# EAGLE design cosv-carrier-teensy40 (EAGLE 7.6.0)
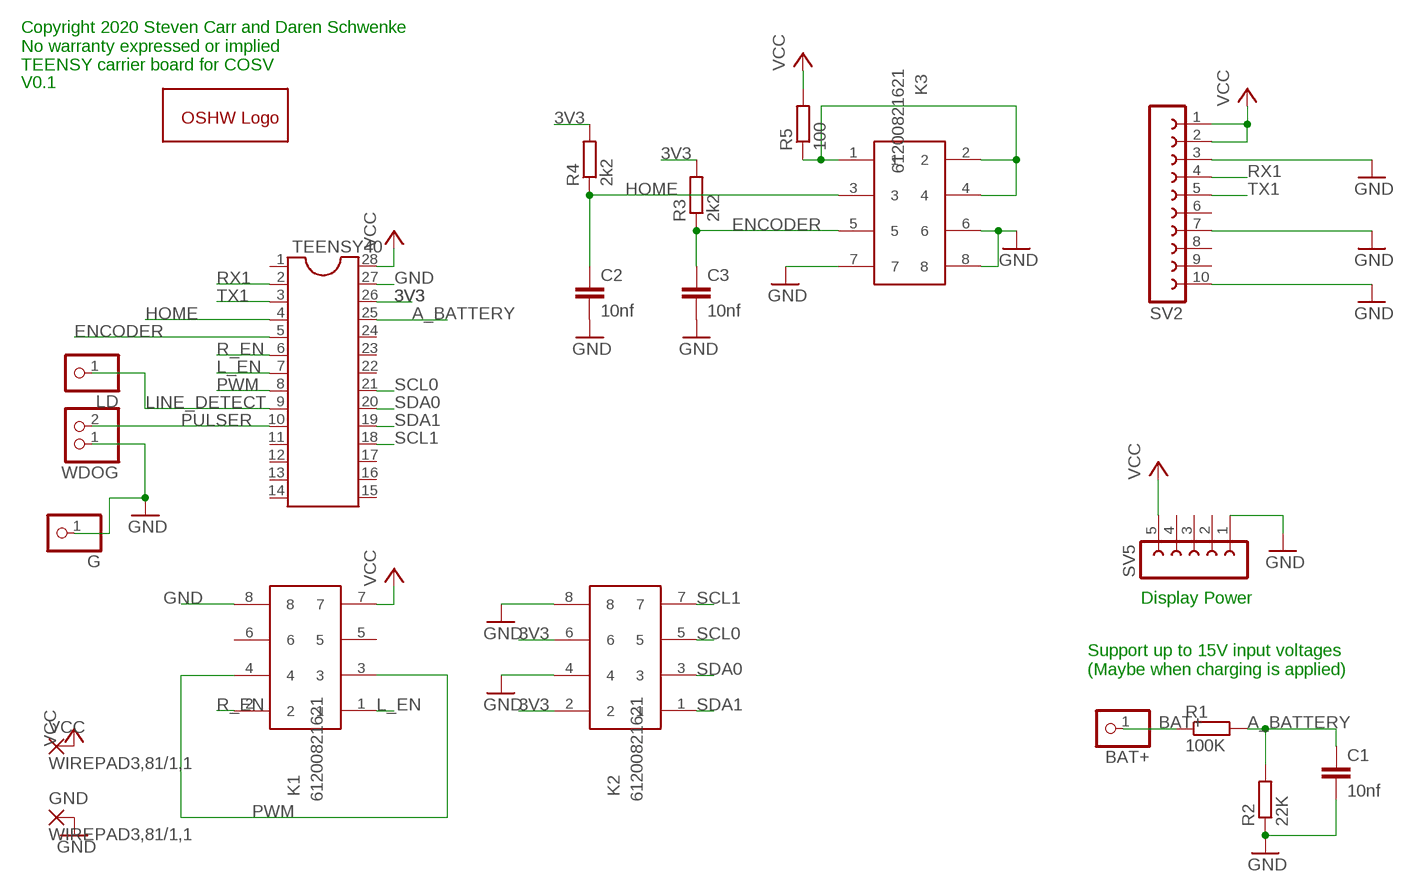
[diagram p0: schematic, sheet 1]

## Parts
BAT+  PINHD-1X01_2.54-S  [1X01-S]
C1  10nf  C-EUC1206  [C1206]
C2  10nf  C-EUC1206  [C1206]
C3  10nf  C-EUC1206  [C1206]
G  PINHD-1X01_2.54-S  [1X01-S]
GND  WIREPAD3,81/1,1  [3,81/1,1]
GOLD_ORB_SM1  OSHWLOGOLOGO8MM  [OSHW_8MM]
K1  61200821621  [61200821621]
K2  61200821621  [61200821621]
K3  61200821621  [61200821621]
LD  PINHD-1X01_2.54-S  [1X01-S]
R1  100K  R-EU_R1206  [R1206]
R2  22K  R-EU_R1206  [R1206]
R3  2k2  R-EU_R1206  [R1206]
R4  2k2  R-EU_R1206  [R1206]
R5  100  R-EU_R1206  [R1206]
SV2  FE10-1  [FE10]
SV5  FE05W  [FE05W]
TEENSY40  DIL28  [DIL28-6]
VCC  WIREPAD3,81/1,1  [3,81/1,1]
WDOG  PINHD-1X2  [1X02]

## Nets
3V3: K2.2 K2.6 R3.2 R4.2 TEENSY40.26
A_BATTERY: C1.1 R1.2 R2.2 TEENSY40.25
BAT+: BAT+.1 R1.1
ENCODER: C3.1 K3.5 R3.1 TEENSY40.5
GND: C1.2 C2.2 C3.2 G.1 GND.1(P) K1.8 K2.4 K2.8 K3.6 K3.7 K3.8 R2.1 SV2.3 SV2.7 SV2.10 SV5.1 TEENSY40.27 WDOG.1
HOME: C2.1 K3.3 R4.1 TEENSY40.4
L_EN: K1.1 TEENSY40.7
LINE_DETECT: LD.1 TEENSY40.9
N$1: K3.1 K3.2 K3.4 R5.1
PULSER: TEENSY40.10 WDOG.2
PWM: K1.3 K1.4 TEENSY40.8
R_EN: K1.2 TEENSY40.6
RX1: SV2.4 TEENSY40.2
SCL0: K2.5 TEENSY40.21
SCL1: K2.7 TEENSY40.18
SDA0: K2.3 TEENSY40.20
SDA1: K2.1 TEENSY40.19
TX1: SV2.5 TEENSY40.3
VCC: K1.7 R5.2 SV2.1 SV2.2 SV5.5 TEENSY40.28 VCC.1(P)
Unconnected: K1.5 K1.6 SV2.6 SV2.8 SV2.9 SV5.2 SV5.3 SV5.4 TEENSY40.1 TEENSY40.11 TEENSY40.12 TEENSY40.13 TEENSY40.14 TEENSY40.15 TEENSY40.16 TEENSY40.17 TEENSY40.22 TEENSY40.23 TEENSY40.24

## Notes on the sheet
- Copyright 2020 Steven Carr and Daren Schwenke
  No warranty expressed or implied
  TEENSY carrier board for COSV
- V0.1
- Display Power
- Support up to 15V input voltages
  (Maybe when charging is applied)

## Library data of the parts
BAT+ G LD = pinhead-2:PINHD-1X01: PIN HEADER
C1-C3 = rcl:C-EU: CAPACITOR, European symbol
GND VCC = wirepad:WIREPAD: Wire PAD connect wire on PCB
GOLD_ORB_SM1 = oshw:OSHWLOGO: The OSHW logo for PCB layout
K1-K3 = Wuerth_Elektronik_eiCan_05_Box_Header_IDC_Connectors_1_2:61200821621: WR-BHD 2.54mm Male Box Header, 8 Pins
R1-R5 = resistor:R-EU_: RESISTOR, European symbol
SV2 = con-lsta:FE10-1: FEMALE HEADER; OC_FARNELL: unknown; OC_NEWARK: unknown
SV5 = con-lsta:FE05W: FEMALE HEADER; OC_FARNELL: unknown; OC_NEWARK: unknown
TEENSY40 = ic-package:DIL28: Dual In Line
WDOG = pinhead:PINHD-1X2: PIN HEADER

## Board
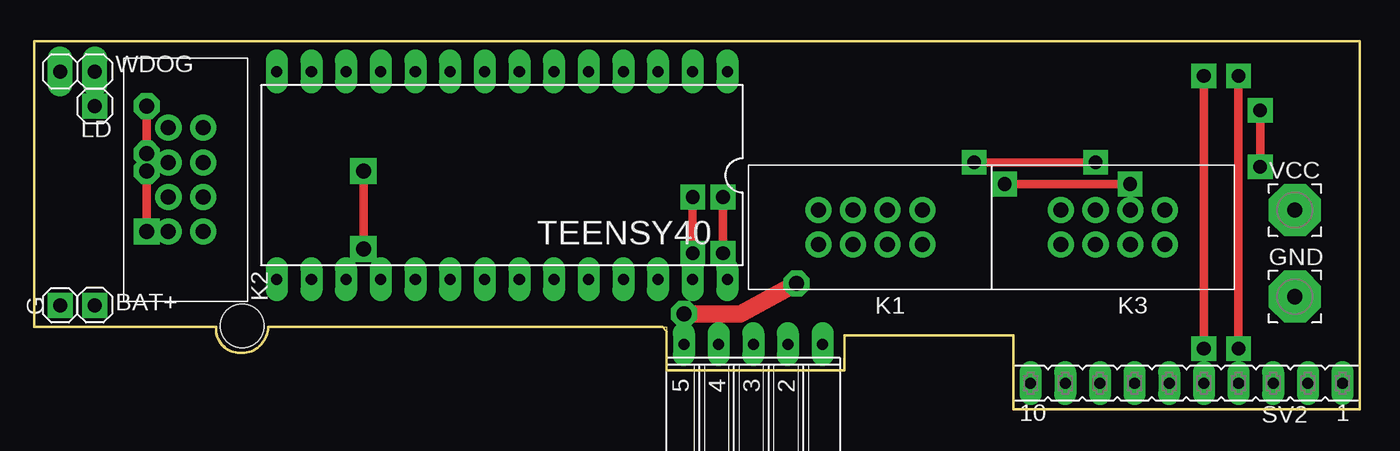
[diagram p1: board, top side]
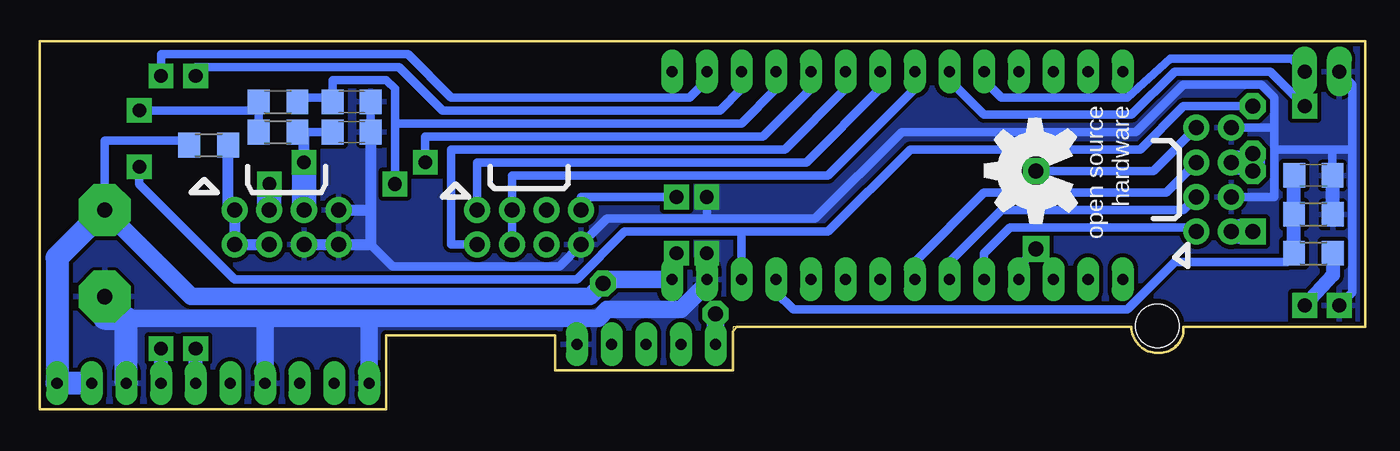
[diagram p2: board, bottom side, seen from below]

Size 97.16 x 26.98 mm. Coordinates in mm from the lower left corner, seen from the top.
Outline: 0,6.03 13.34,6.03 arc90 15.24,4.13 arc90 17.14,6.03 46.36,6.03 46.36,2.86 59.37,2.86 59.37,5.4 71.76,5.4 71.76,0 97.16,0 97.16,26.98 0.01,26.98 0,26.67 0,6.03
Copper layers (1*16): Top 0.035559375mm / dielectric 1.6mm / Bottom 0.035559375mm
Design rules "oshpark-2layer *": minimum track width 6mil, minimum drill 10mil, track to track 6mil, track to pad 6mil, pad to pad 6mil, via to via 6mil, smd to smd 6mil, copper to edge 15mil, drill to drill 6mil, minimum pad ring 16mil, minimum via ring 16mil, stop-mask expansion 2.5mil, vias tented up to drill 0mil, thermal gap 10mil
Holes 3.2 mm at 15.24,6.11
Milling: 15 lines

### Footprints (pad centres in the part's own frame; a part is rotated, then mirrored left to right if it is on the bottom)
1X01-S = drill 1.016 square: 1 0,0
C1206 = smd 1.6 x 1.8: 1 -1.4,0; 2 1.4,0
3,81/1,1 = drill 1.118 pad 3.81 octagon: 1 0,0
61200821621 = drill 1.1: 1 -2.54,-1.27; 2 -2.54,1.27; 3 0,-1.27; 4 0,1.27; 5 2.54,-1.27; 6 2.54,1.27; 7 5.08,-1.27; 8 5.08,1.27
R1206 = smd 1.6 x 1.803: 1 -1.422,0; 2 1.422,0
FE10 = drill 0.813 long: 1 -11.43,0; 2 -8.89,0; 3 -6.35,0; 4 -3.81,0; 5 -1.27,0; 6 1.27,0; 7 3.81,0; 8 6.35,0; 9 8.89,0; 10 11.43,0
FE05W = drill 0.813 long: 1 -5.08,0; 2 -2.54,0; 3 0,0; 4 2.54,0; 5 5.08,0
DIL28-6 = drill 0.813 long: 1 -16.51,-7.62; 2 -13.97,-7.62; 3 -11.43,-7.62; 4 -8.89,-7.62; 5 -6.35,-7.62; 6 -3.81,-7.62; 7 -1.27,-7.62; 8 1.27,-7.62; 9 3.81,-7.62; 10 6.35,-7.62; 11 8.89,-7.62; 12 11.43,-7.62; 13 13.97,-7.62; 14 16.51,-7.62; 15 16.51,7.62; 16 13.97,7.62; 17 11.43,7.62; 18 8.89,7.62; 19 6.35,7.62; 20 3.81,7.62; 21 1.27,7.62; 22 -1.27,7.62; 23 -3.81,7.62; 24 -6.35,7.62; 25 -8.89,7.62; 26 -11.43,7.62; 27 -13.97,7.62; 28 -16.51,7.62
1X02 = drill 1.016 long: 1 -1.27,0; 2 1.27,0

### Placement (x,y rotation side)
BAT+  4.45,7.62 270 top
C1  3.81,17.15 0 bottom
C2  74.3,22.54 0 bottom
C3  74.3,20.32 0 bottom
G  1.91,7.62 0 top
GND  92.39,8.25 0 top
GOLD_ORB_SM1  24.13,17.46 90 bottom
K1  62.55,13.33 180 top
K2  11.11,15.56 90 top
K3  80.33,13.33 180 top
LD  4.45,22.23 0 top
R1  3.81,11.43 180 bottom
R2  3.81,14.29 180 bottom
R3  79.69,20.32 180 bottom
R4  79.69,22.54 180 bottom
R5  84.77,19.37 180 bottom
SV2  84.45,1.91 180 top
SV5  52.71,4.76 180 top
TEENSY40  34.29,17.15 180 top
VCC  92.39,14.6 0 top
WDOG  3.17,24.77 0 top

### Tracks (layer width: path | path; a pad name or v marks a point on that pad's centre or on a via)
3V3  (via drill 1, 1.1)
  Top 0.61: v89.85,21.91 v89.85,17.78 | v8.25,22.22 v8.25,18.73 | v8.25,13.02 v8.25,17.46
  Bottom 0.61: 45.72,13.02 39.37,13.02 33.34,19.05 16.51,19.05 13.34,22.22 v8.25,22.22 | 45.72,13.02 TEENSY40.26 | 45.72,13.02 54.29,13.02 57.79,9.53 82.87,9.53 89.85,16.51 v89.85,17.78 | R3.2 R4.2 81.12,22.39 81.6,21.91 v89.85,21.91
  Bottom 1.778: v8.25,18.73 8.25,18.1 | 8.25,18.1 K2.6 | v8.25,17.46 8.25,18.1 | v8.25,13.02 K2.2
A_BATTERY
  Bottom 0.61: TEENSY40.25 43.18,8.57 41.91,7.3 17.46,7.3 13.97,10.8 5.72,10.8 5.23,11.28 R1.2
  Bottom 1.016: 5.21,17.46 C1.1 5.23,17.12 R2.2 R1.2
BAT+
  Bottom 1.016: BAT+.1 2.39,9.84 R1.1
ENCODER  (via drill 1)
  Top 0.61: v68.9,18.1 v77.79,18.1
  Bottom 0.61: TEENSY40.5 40.64,23.49 44.13,20 68.9,20 v68.9,18.1 | C3.1 75.7,20.13 75.88,20.32 R3.1
  Bottom 0.813: v77.79,18.1 77.79,20 78.27,20.49 R3.1
  Bottom 1.778: K3.5 v77.79,18.1
GND  (via drill 1)
  Top 0.61: v48.26,11.43 v48.26,15.56
  Bottom 0.61: 48.26,13.97 40.32,13.97 33.97,20.32 16.83,20.32 13.34,23.81 7.62,23.81 6.67,22.86 6.67,20.64 | 48.26,13.97 55.56,13.97 K1.8 59.05,10.48 71.31,10.48 72.89,12.06 | 2.41,16.83 C1.2 2.41,18.92 2.54,19.05 | 6.67,19.05 6.67,15.56 K2.4 | 2.54,19.05 6.67,19.05 | G.1 0.95,8.57 0.95,19.05 | 0.95,19.05 2.54,19.05 | v48.26,15.56 48.26,13.97 | v48.26,11.43 TEENSY40.27 | 6.67,20.64 6.67,19.05 | K2.8 6.67,20.64 | C3.2 C2.2 | WDOG.1 0.95,23.81 0.95,19.05
  Bottom 0.813: C3.2 72.89,14.6 | 72.89,14.6 72.89,12.06 K3.8 K3.6 | K3.7 72.89,14.6
  Bottom 1.016: R2.1 2.39,17.12 C1.2
  Bottom 1.27: 57.79,6.67 73.03,6.67 | 73.03,6.67 80.64,6.67 | SV2.7 80.64,6.67 | SV2.10 73.03,6.67 | SV5.1 57.79,6.67 | 90.81,6.67 80.64,6.67 | 57.79,6.67 56.2,6.67 55.56,7.3 50.17,7.3 48.26,9.21 TEENSY40.27
  Bottom 1.676: SV2.3 90.81,6.67 92.39,6.67 GND.1
  pour Bottom (isolate 0.305): 0.32,6.03 0.32,26.67 97.47,26.67 97.47,0 71.76,0 71.76,5.71 59.37,5.71 59.37,3.18 46.36,3.18 46.36,6.03
HOME  (via drill 1)
  Top 0.61: v71.12,16.51 v80.33,16.51
  Bottom 0.61: TEENSY40.4 43.18,23.49 45.72,20.96 71.12,20.96 | 71.12,20.96 v71.12,16.51 | 71.12,20.96 71.12,23.49 71.76,24.13 75.7,24.13 C2.1 75.7,22.67 75.88,22.86 77.95,22.86 R4.1
  Bottom 1.778: K3.3 v80.33,16.51
L_EN
  Bottom 0.61: TEENSY40.7 35.56,23.49 40.96,18.1 65.09,18.1 K1.1
LINE_DETECT
  Bottom 0.61: TEENSY40.9 30.48,24.13 27.94,21.59 17.14,21.59 13.97,24.76 6.99,24.76 LD.1
N$1
  Bottom 0.813: R5.1 83.35,15.09 K3.1 K3.2 K3.4
PULSER
  Bottom 0.61: TEENSY40.10 27.94,24.13 26.67,22.86 17.46,22.86 14.29,25.72 5.4,25.72 WDOG.2
PWM
  Bottom 0.61: K1.4 K1.3 62.55,17.15 39.37,17.15 33.02,23.49 TEENSY40.8
R_EN
  Bottom 0.61: TEENSY40.6 38.1,23.49 42.55,19.05 66.99,19.05 66.99,12.06 K1.2
RX1  (via drill 1)
  Top 0.61: v88.27,4.44 v88.27,24.45
  Bottom 0.61: TEENSY40.2 48.26,24.13 49.53,22.86 66.99,22.86 70.17,26.03 88.27,26.03 v88.27,24.45
  Bottom 1.016: SV2.4 v88.27,4.44
SCL0
  Bottom 0.61: TEENSY40.21 33.02,10.8 27.94,15.87 14.61,15.87 K2.5
SCL1  (via drill 1.1)
  Top 0.61: v24.13,17.46 v24.13,11.75
  Bottom 0.61: v24.13,11.75 25.4,10.48 TEENSY40.18 | K2.7 15.56,17.46 v24.13,17.46
SDA0
  Bottom 0.61: TEENSY40.20 30.48,10.8 26.67,14.6 13.34,14.6 K2.3
SDA1
  Bottom 0.61: K2.1 12.7,13.33 26.04,13.33 27.94,11.43 TEENSY40.19
TX1  (via drill 1)
  Top 0.61: v85.73,4.44 v85.73,24.45
  Bottom 0.61: TEENSY40.3 45.72,23.49 47.31,21.91 67.63,21.91 70.8,25.08 85.73,25.08 v85.73,24.45
  Bottom 1.016: SV2.5 v85.73,4.44
VCC  (via drill 1, 1.1)
  Top 0.61: v50.48,15.56 v50.48,11.43
  Top 1.27: v47.62,6.98 51.75,6.98 v55.88,9.21
  Bottom 0.61: K1.7 57.47,15.56 v50.48,15.56 | 86.36,19.2 86.36,19.37 86.68,19.69 92.39,19.69 VCC.1 | v50.48,11.43 50.48,9.84 TEENSY40.28
  Bottom 0.813: R5.2 86.36,19.2
  Bottom 1.27: TEENSY40.28 55.56,9.53 v55.88,9.21 56.83,8.25 86.04,8.25 VCC.1 | SV5.5 v47.62,6.98
  Bottom 1.676: SV2.2 SV2.1 95.89,11.11 VCC.1

### Text on the board
tValues: gnd | scl1 | 3v3 | scl0 | gnd | sda0 | vcc | PWM | gnd | enc | home | REN | 3v3 | 3v3 | sda1 | gnd | LEN | PWM | gnd | vcc
bValues: TEENSY 4.0 Carrier Board for COSV / (c) 2020 Steven Carr and Daren Schwenke | V0.1